# Altium schematic sheet 1_Power.SchDoc: Power
size A4; DrawnBy: Cristian Oprea; Revision: 1; SheetNumber: 1; SheetTotal: 4
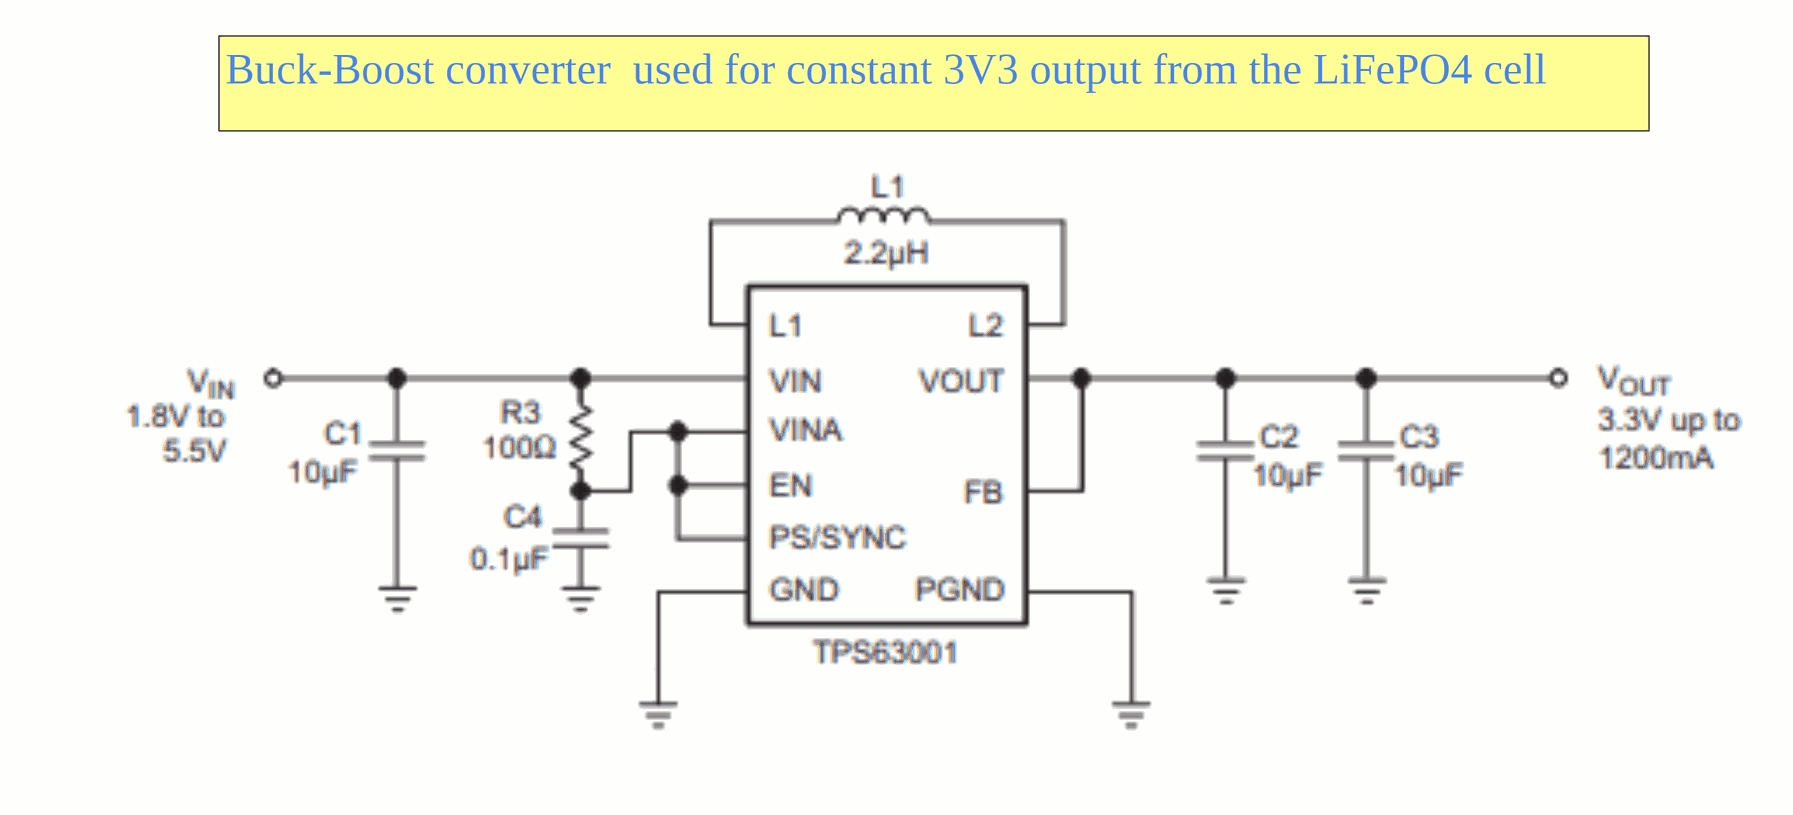
[diagram p0: 1_Power.SchDoc, top left]
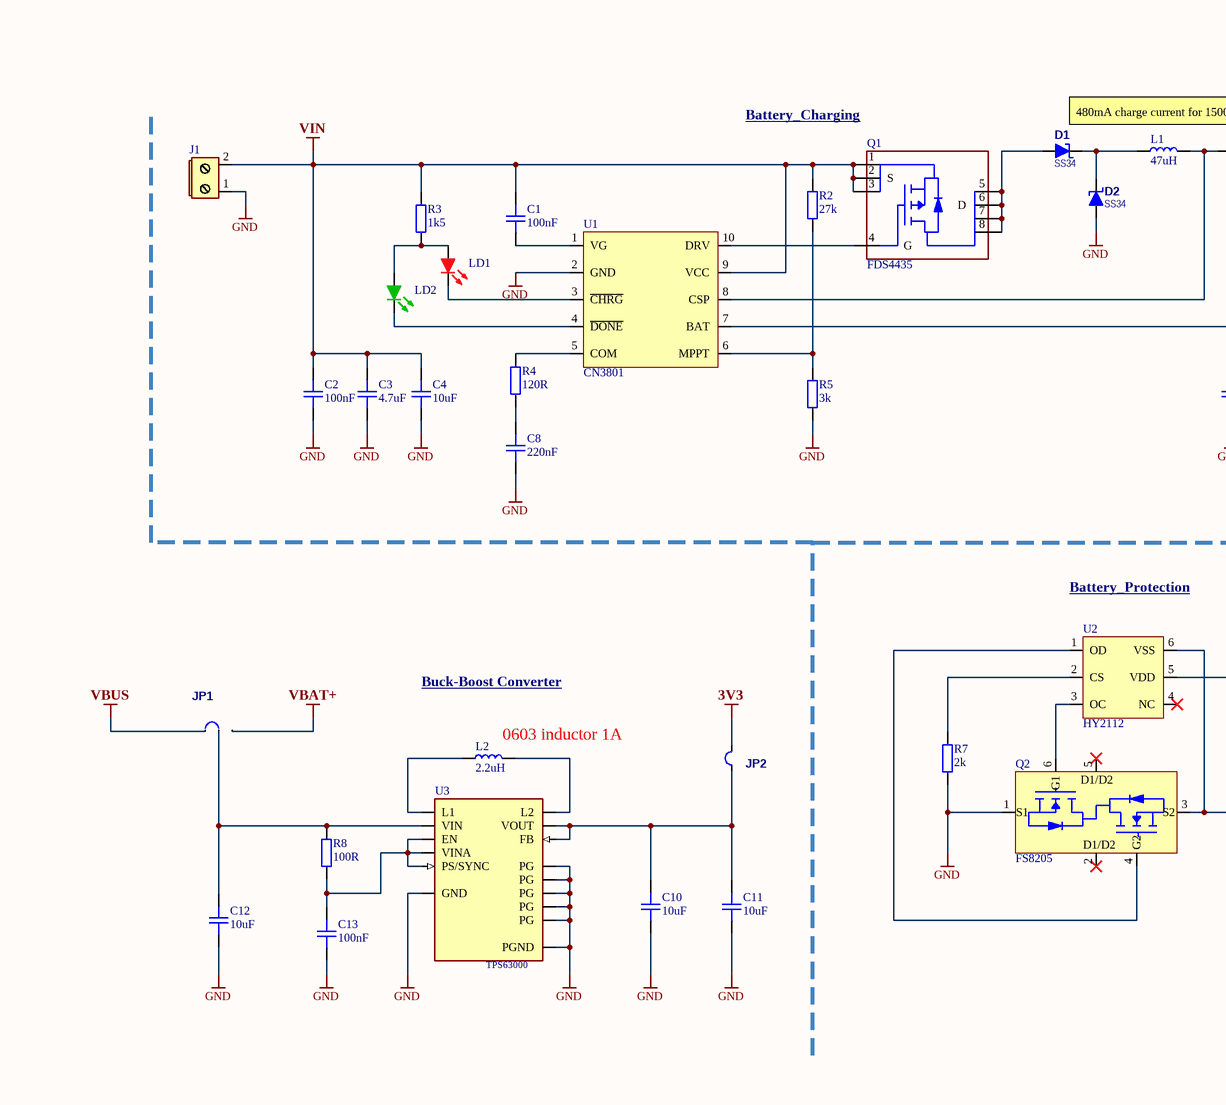
[diagram p1: 1_Power.SchDoc, top middle]
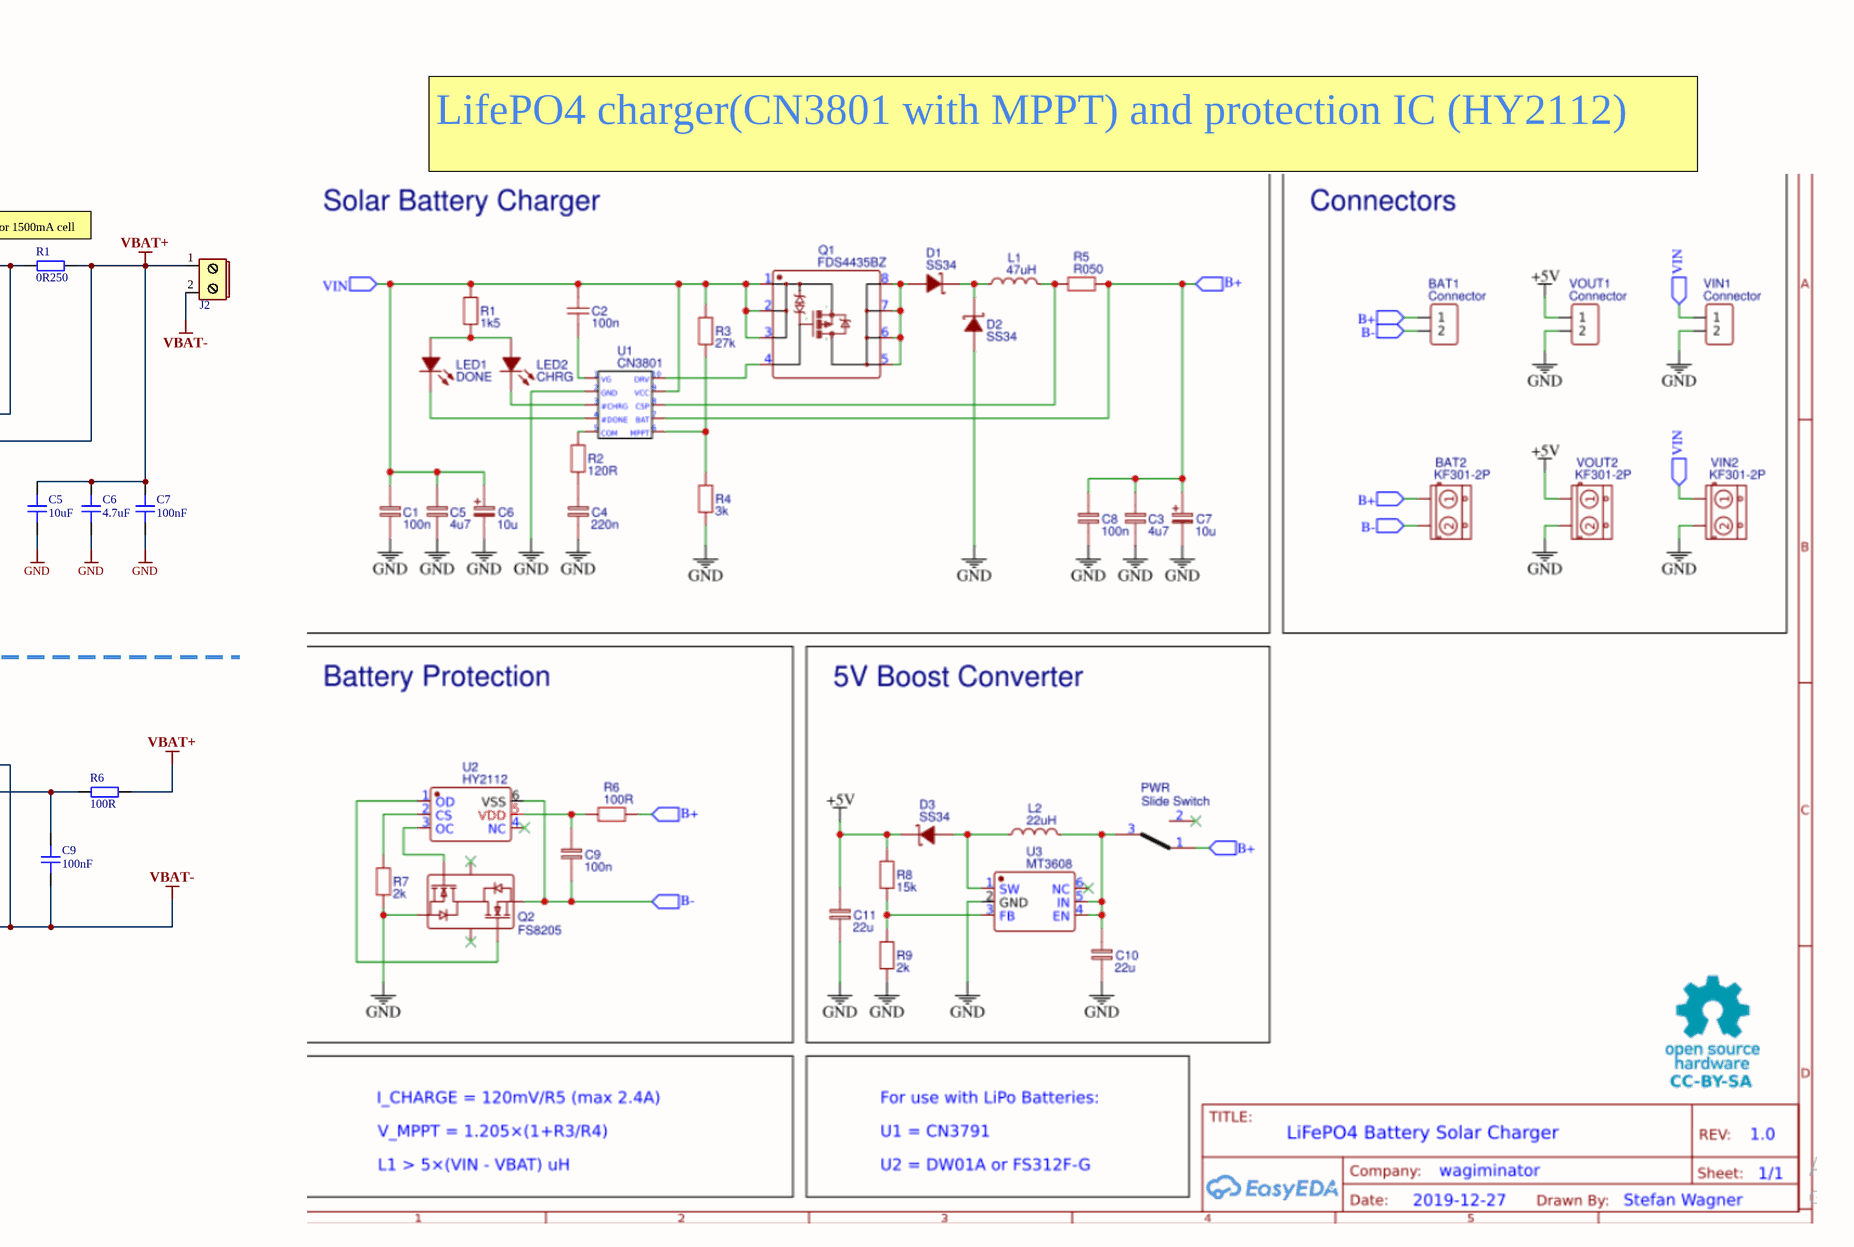
[diagram p2: 1_Power.SchDoc, top right]
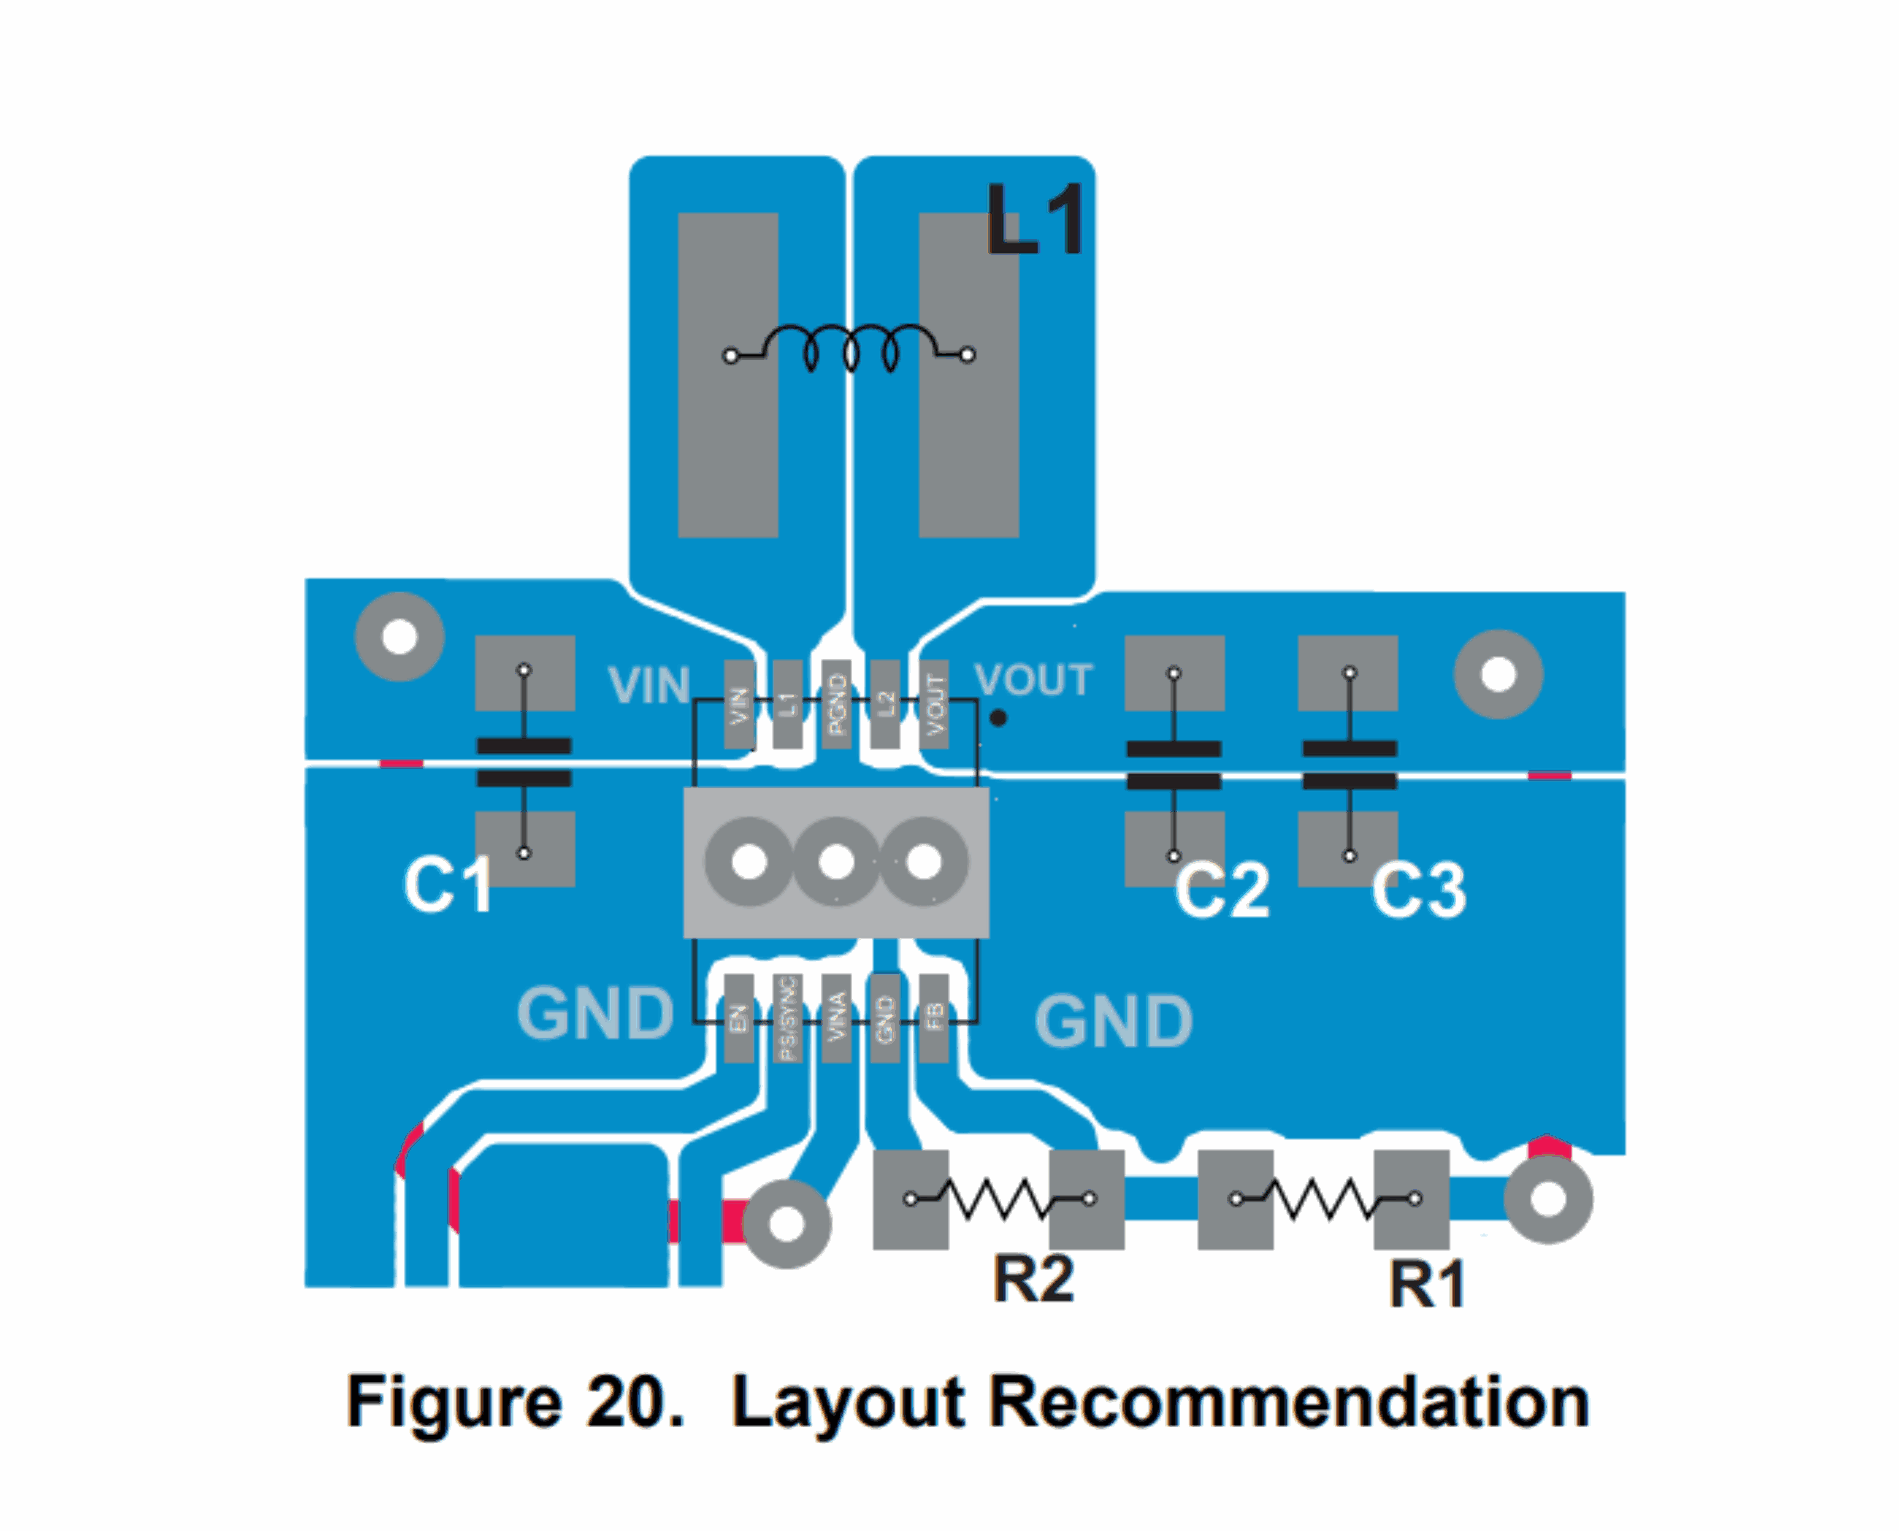
[diagram p3: 1_Power.SchDoc, bottom left]

## Parts
C1  100nF  [C0603]
C2  100nF  [C0603]
C3  4.7uF  [C0603]
C4  10uF  [C0805]
C5  10uF  [C0805]
C6  4.7uF  [C0603]
C7  100nF  [C0603]
C8  220nF  [C0603]
C9  100nF  [C0603]
C10  10uF  [C0805]
C11  10uF  [C0805]
C12  10uF  [C0805]
C13  100nF  [C0603]
D1  SS34  [DO-214AC]
D2  SS34  [DO-214AC]
J1  PLUGIN_TERMINAL  [2.54_pluggable_terminal]  (value not drawn)
J2  PLUGIN_TERMINAL  [HEADER_1x2_2.54]  (value not drawn)
JP1  JUMPER_3PIN  [HEADER_1x3_2.54]  (value not drawn)
JP2  JUMPER  [HEADER_1x2_2.54]  (value not drawn)
L1  47uH  [IND_5_7]
L2  2.2uH  [L0603]
LD1  LED_RED  [LED0603RD]  (value not drawn)
LD2  LED_GREEN  [LED0603GR]  (value not drawn)
Q1  FDS4435  [SOIC-SN8_N]
Q2  FS8205  [SOT23-6]
R1  0R250  [R2512]
R2  27k  [R0603]
R3  1k5  [R0603]
R4  120R  [R0603]
R5  3k  [R0603]
R6  100R  [R0603]
R7  2k  [R0603]
R8  100R  [R0603]
U1  CN3801  [SSOP-10]
U2  HY2112  [SOT23-6]
U3  TPS63001  [VREG_V62/16624-01YE]  (value not drawn)

## Nets
3V3: JP2.2
GND: C2.1 C3.1 C4.1 C5.1 C6.1 C7.1 C8.1 C10.1 C11.1 C12.1 C13.1 D2.1(A) J1.1 Q2.1(S1) R5.1 R7.1 U1.2(GND) U3.3(PGND) U3.9(GND) U3.11(PG)
VBAT+: C5.2 C6.2 C7.2 J2.1 JP1.3 R1.2 R6.1 U1.7(BAT)
VBAT-: C9.1 J2.2 Q2.3(S2) U2.6(VSS)
VBUS: JP1.1
VIN: C1.2 C2.2 C3.2 C4.2 J1.2 Q1.1(S) Q1.2(S) Q1.3(S) R2.2 R3.2 U1.9(VCC)
NetC1_1: C1.1 U1.1(VG)
NetC8_2: C8.2 R4.1
NetC9_2: C9.2 R6.2 U2.5(VDD)
NetC10_2: C10.2 C11.2 JP2.1 U3.1(VOUT) U3.10(FB)
NetC12_2: C12.2 JP1.2 R8.2 U3.5(VIN)
NetC13_2: C13.2 R8.1 U3.6(EN) U3.7(PS/SYNC) U3.8(VINA)
NetD1_1: D1.1(A) Q1.5(D) Q1.6(D) Q1.7(D) Q1.8(D)
NetD1_2: D1.2(K) D2.2(K) L1.1
NetL1_2: L1.2 R1.1 U1.8(CSP)
NetL2_1: L2.1 U3.4(L1)
NetL2_2: L2.2 U3.2(L2)
NetLD1_1: LD1.1(A) LD2.1(A) R3.1
NetLD1_2: LD1.2(K) U1.3(~{CHRG})
NetLD2_2: LD2.2(K) U1.4(~{DONE})
NetQ1_4: Q1.4(G) U1.10(DRV)
NetQ2_4: Q2.4(G2) U2.1(OD)
NetQ2_6: Q2.6(G1) U2.3(OC)
NetR2_1: R2.1 R5.2 U1.6(MPPT)
NetR4_2: R4.2 U1.5(COM)
NetR7_2: R7.2 U2.2(CS)

Not connected (* = marked no-connect by the designer): Q2 2(D1/D2)* 5(D1/D2)*; U2 4(NC)*

## Notes on the sheet
- Buck-Boost converter  used for constant 3V3 output from the LiFePO4 cell
- LifePO4 charger(CN3801 with MPPT) and protection IC (HY2112)
- Battery_Charging
- 480mA charge current for 1500mA cell
- Switching between VBUS and Battery Power for debugging
- Battery_Protection
- Overcharge, Overdischarge, Overcurrent, Short-circuit protection
- Buck-Boost Converter
- 3V3 could be interrupted for testing or current measurement
- (near L2) 0603 inductor 1A

## Library data of the parts
C1-C3 C6-C9 C13 = CAP_0603: Capacitor SMD 0603; Manufacturer: *; Manufacturer Part Number: *; Distributor Link: *; LCSC: *; Rating: *; Dielectric: *
C4 C5 C10-C12 = CAP_0805: Capacitor SMD 0805; Manufacturer: *; Manufacturer Part Number: *; Distributor Link: *; LCSC: *; Rating: *; Dielectric: *
D1 D2 = DIODE_SCHOTTKY: Diode; Manufacturer Part Number 1: *; PackageReference: *
J1 J2 = Power_Connector: Screw terminal or plug terminal for power
JP1 = JUMPER_3PIN: *; PackageReference: *; Manufacturer Part Number 1: *
JP2 = JUMPER: *; PackageReference: *; Manufacturer Part Number 1: *
L1 = IND_0603: Inductor SMD 0603
L2 = IND_1008: Inductor SMD 1008
LD1 = LED_RED: Typical BLUE SiC LED; Published: 8-Jun-2000; LatestRevisionDate: 17-Dec-2003; LatestRevisionNote: PCB Footprint replaced.; DatasheetVersion: 16-Apr-2002; PackageVersion: 16-Apr-2002; Publisher: Altium Limited; PackageDescription: SM LED; 2 C-Bend Leads; Body 3.5 x 2.8 x 1.9 mm, inc leads (LxWxH typ); Manufacturer Part Number 1: *; PackageReference: 3.5X2.8X1.9
LD2 = LED_GREEN: Typical BLUE SiC LED; Published: 8-Jun-2000; LatestRevisionDate: 17-Dec-2003; LatestRevisionNote: PCB Footprint replaced.; DatasheetVersion: 16-Apr-2002; PackageVersion: 16-Apr-2002; Publisher: Altium Limited; PackageDescription: SM LED; 2 C-Bend Leads; Body 3.5 x 2.8 x 1.9 mm, inc leads (LxWxH typ); Manufacturer Part Number 1: *; PackageReference: 3.5X2.8X1.9
R1 = RES_0805: Resistor SMD 0805; Manufacturer: *; Manufacturer Part Number: *; Distributor Link: *; LCSC: *
R2-R6 R8 = RES_0603: Resistor SMD 0603; Manufacturer: *; Manufacturer Part Number: *; Distributor Link: *; LCSC: *
R7 = RES_0603_1: Resistor SMD 0603; Manufacturer: *; Manufacturer Part Number: *; Distributor Link: *; LCSC: *
U1 = CN3801: LiFePO4 charge IC with integrated MPPT and wide input range (4.5 to 28V) with deeply discharged cell revive
U2 = HY2112: LiFePO4 protection IC
U3 = TPS63000: Buck-Boost Switching Regulator IC Positive Adjustable 1.2V 1 Output 1.6A _Switch_ 10-VFDFN Exposed Pad; MF: Texas Instruments; Package: QFN-10 Texas Instruments; SnapEDA_Link: https://www.snapeda.com/parts/TPS63000/Texas%20Instruments/view-part/572521/?ref=snap; MP: TPS63000; Value: *; Availability: Unavailable; Price: None